# EAGLE design CPM_Pmod (EAGLE 6.4)
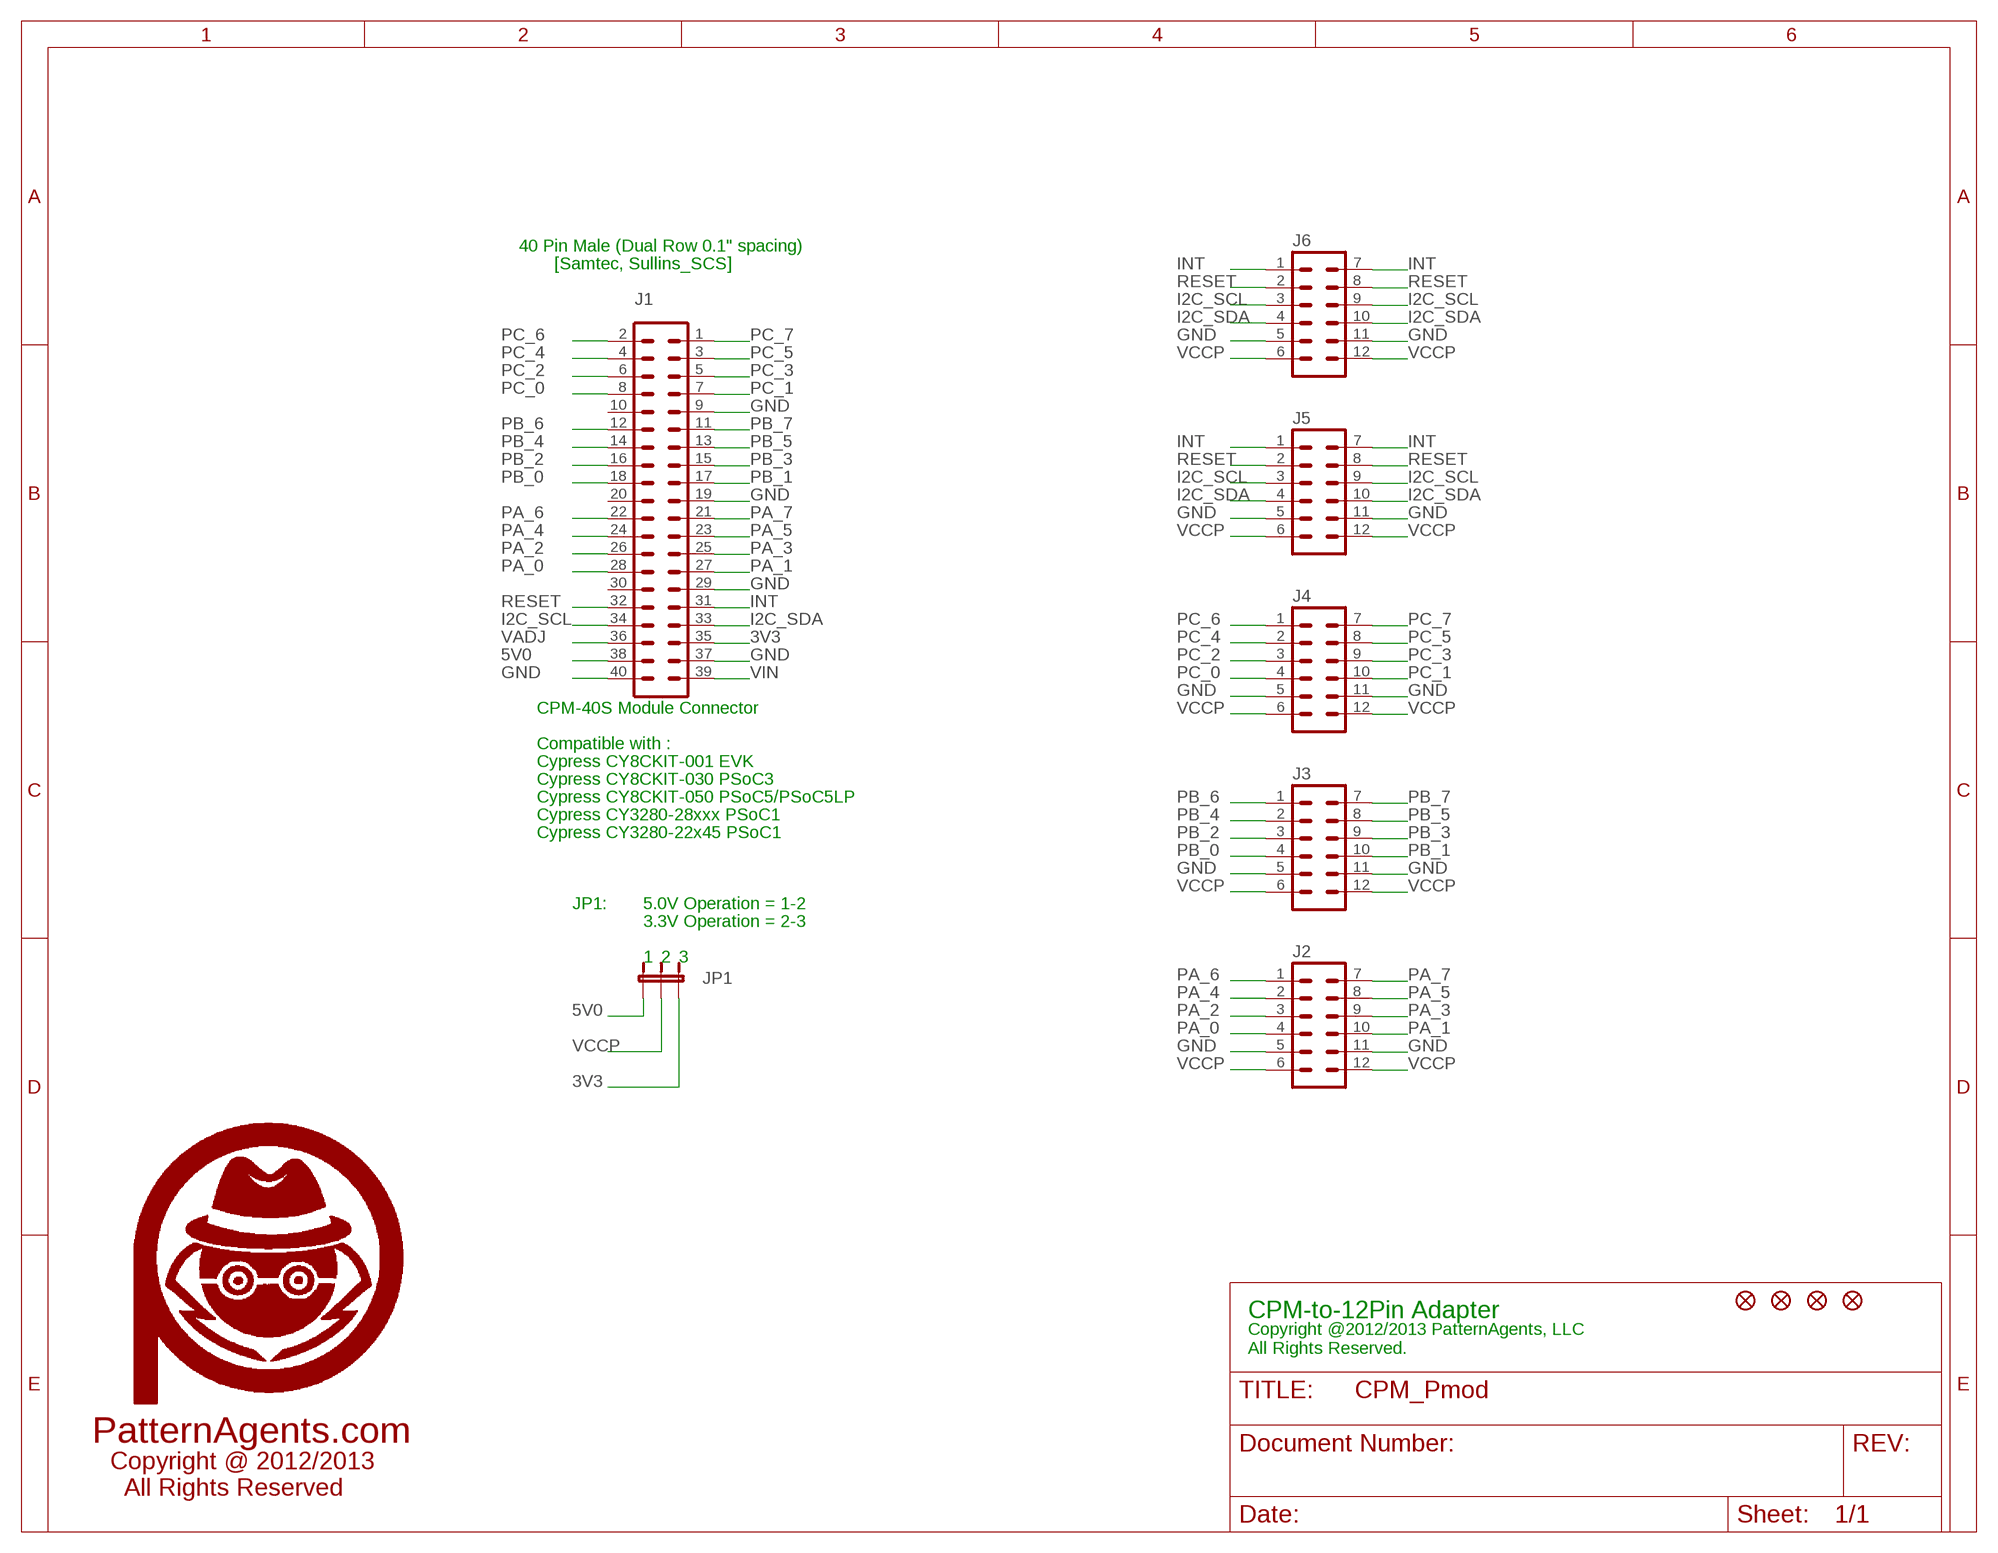
[diagram p0: schematic, sheet 1]

## Parts
J1  SULLINS_SCS  MA20-2  [MA20-2]
J2  MA06-2-PMOD  [MA06-2-PMOD]
J3  MA06-2-PMOD  [MA06-2-PMOD]
J4  MA06-2-PMOD  [MA06-2-PMOD]
J5  MA06-2-PMOD  [MA06-2-PMOD]
J6  MA06-2-PMOD  [MA06-2-PMOD]
JP1  JUMPER-3PTH  [1X03]
JP2  FIDUCIAL1.5X3  [FIDUCIAL-1.5X3]
JP3  FIDUCIAL1.5X3  [FIDUCIAL-1.5X3]
JP4  FIDUCIAL1.5X3  [FIDUCIAL-1.5X3]
JP5  FIDUCIAL1.5X3  [FIDUCIAL-1.5X3]
U$1  LOGO_PA_AGENTLARGE  [LOGO_PA_AGENT_LARGE]

## Nets
3V3: J1.35 JP1.3
5V0: J1.38 JP1.1
GND: J1.9 J1.19 J1.29 J1.37 J1.40 J2.5 J2.11 J3.5 J3.11 J4.5 J4.11 J5.5 J5.11 J6.5 J6.11
I2C_SCL: J1.34 J5.3 J5.9 J6.3 J6.9
I2C_SDA: J1.33 J5.4 J5.10 J6.4 J6.10
INT: J1.31 J5.1 J5.7 J6.1 J6.7
PA_0: J1.28 J2.4
PA_1: J1.27 J2.10
PA_2: J1.26 J2.3
PA_3: J1.25 J2.9
PA_4: J1.24 J2.2
PA_5: J1.23 J2.8
PA_6: J1.22 J2.1
PA_7: J1.21 J2.7
PB_0: J1.18 J3.4
PB_1: J1.17 J3.10
PB_2: J1.16 J3.3
PB_3: J1.15 J3.9
PB_4: J1.14 J3.2
PB_5: J1.13 J3.8
PB_6: J1.12 J3.1
PB_7: J1.11 J3.7
PC_0: J1.8 J4.4
PC_1: J1.7 J4.10
PC_2: J1.6 J4.3
PC_3: J1.5 J4.9
PC_4: J1.4 J4.2
PC_5: J1.3 J4.8
PC_6: J1.2 J4.1
PC_7: J1.1 J4.7
RESET: J1.32 J5.2 J5.8 J6.2 J6.8
VADJ: J1.36
VCCP: J2.6 J2.12 J3.6 J3.12 J4.6 J4.12 J5.6 J5.12 J6.6 J6.12 JP1.2
VIN: J1.39
Unconnected: J1.10 J1.20 J1.30

## Notes on the sheet
- 40 Pin Male (Dual Row 0.1" spacing)
- [Samtec, Sullins_SCS]
- CPM-40S Module Connector
- Compatible with :
- Cypress CY8CKIT-001 EVK
- Cypress CY8CKIT-030 PSoC3
- Cypress CY8CKIT-050 PSoC5/PSoC5LP
- Cypress CY3280-28xxx PSoC1
- Cypress CY3280-22x45 PSoC1
- JP1: | 5.0V Operation = 1-2
- 3.3V Operation = 2-3
- 1 | 2 | 3
- CPM-to-12Pin Adapter
- Copyright @2012/2013 PatternAgents, LLC
  All Rights Reserved.
- PatternAgents.com
- Copyright @ 2012/2013
    All Rights Reserved

## Library data of the parts
J1 = moxdes_V1_0:MA20-2: 40 PIN HEADER; MF: Sullins; MPN: PBC20DBAN; OC_FARNELL: unknown; OC_NEWARK: unknown
J2-J6 = moxdes_V1_0:MA06-2-PMOD
JP1 = SparkFun:JUMPER-3
JP2-JP5 = PatternAgents-Misc:FIDUCIAL: Fiducial Alignment Points Various fiducial points for machine vision alignment.
U$1 = PatternAgents-Aesthetics:LOGO_PA_AGENT: PatternAgents Logo Copyright @2012/2013 PatternAgents.com

## Board
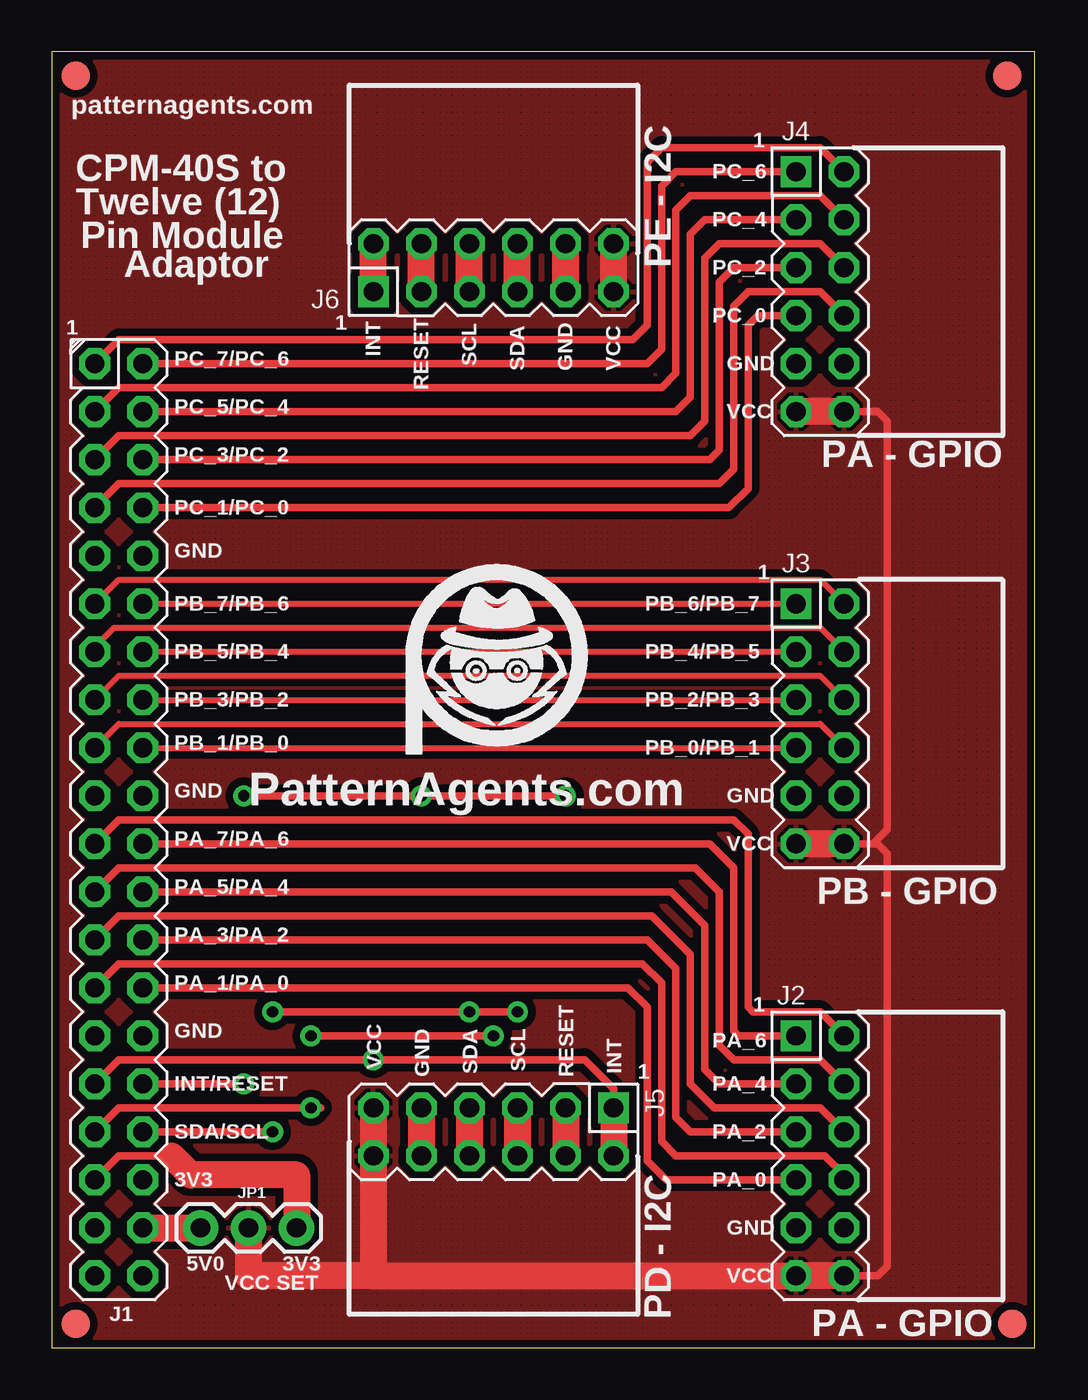
[diagram p1: board, top side]
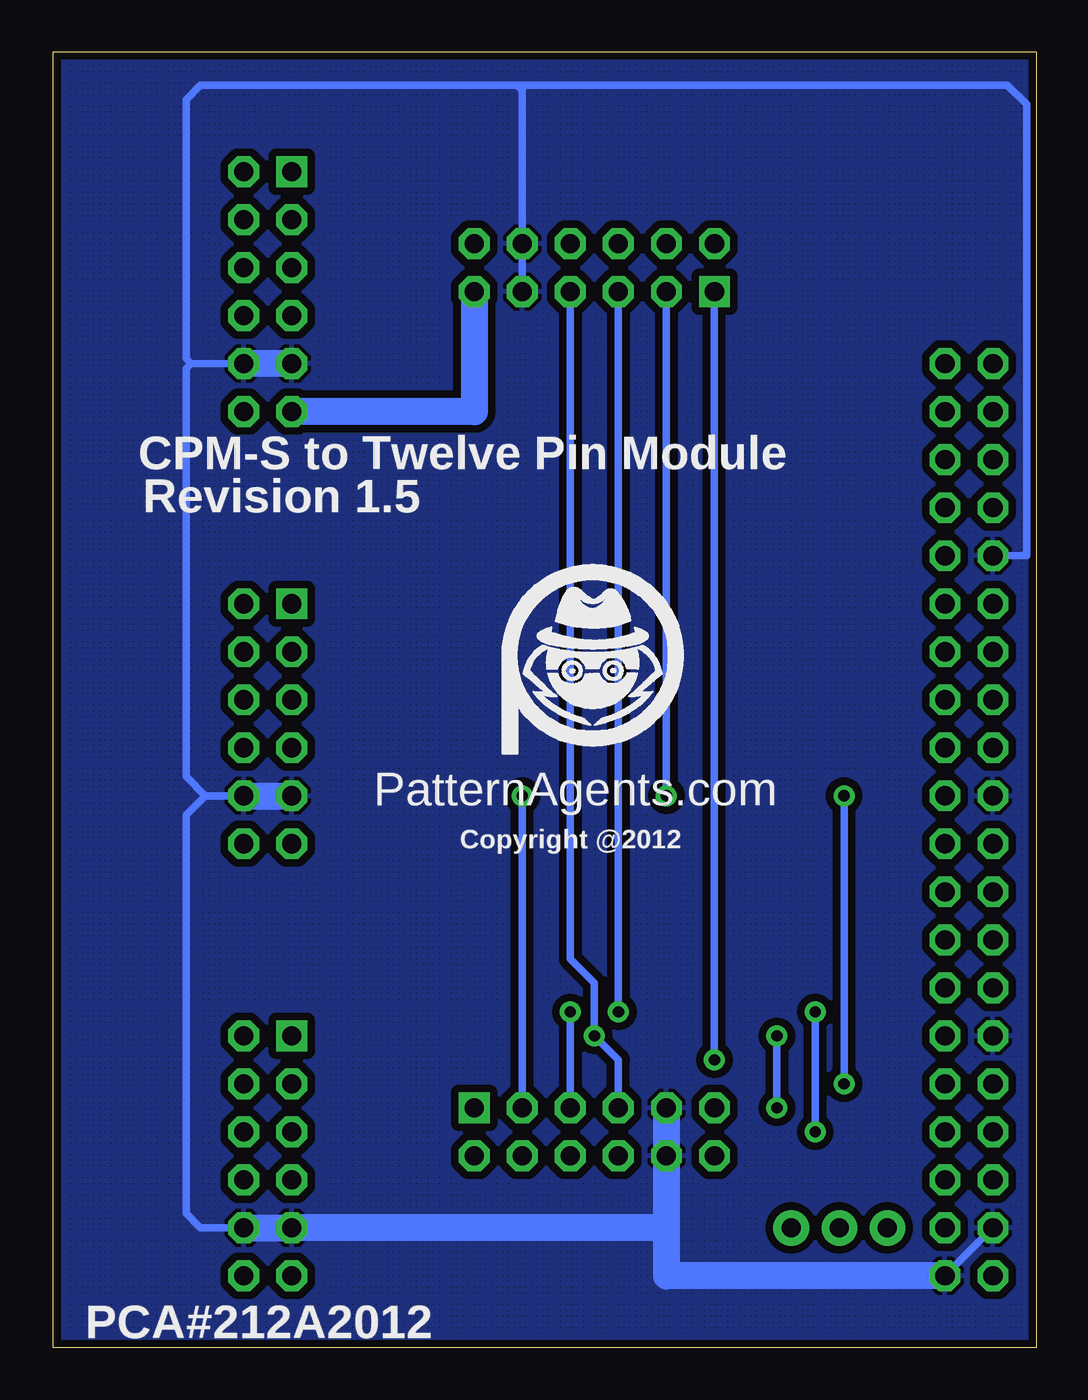
[diagram p2: board, bottom side, seen from below]

Size 51.99 x 68.57 mm. Coordinates in mm from the lower left corner, seen from the top.
Outline: 0,0 51.99,0 51.99,68.57 0,68.57 0,0
Copper layers (1*16): Top 0.035mm / dielectric 1.5mm / Bottom 0.035mm
Design rules "PatternAgents": minimum track width 8mil, minimum drill 14mil, track to track 8mil, track to pad 8mil, pad to pad 8mil, via to via 8mil, smd to smd 8mil, copper to edge 10mil, drill to drill 8mil, minimum pad ring 12mil, minimum via ring 10mil, stop-mask expansion 4mil, vias tented up to drill 25mil, thermal gap 8mil

### Footprints (pad centres in the part's own frame; a part is rotated, then mirrored left to right if it is on the bottom)
MA20-2 = drill 1.016 octagon: 1 -24.13,-1.27; 2 -24.13,1.27; 3 -21.59,-1.27; 4 -21.59,1.27; 5 -19.05,-1.27; 6 -19.05,1.27; 7 -16.51,-1.27; 8 -16.51,1.27; 9 -13.97,-1.27; 10 -13.97,1.27; 11 -11.43,-1.27; 12 -11.43,1.27; 13 -8.89,-1.27; 14 -8.89,1.27; 15 -6.35,-1.27; 16 -6.35,1.27; 17 -3.81,-1.27; 18 -3.81,1.27; 19 -1.27,-1.27; 20 -1.27,1.27; 21 1.27,-1.27; 22 1.27,1.27; 23 3.81,-1.27; 24 3.81,1.27; 25 6.35,-1.27; 26 6.35,1.27; 27 8.89,-1.27; 28 8.89,1.27; 29 11.43,-1.27; 30 11.43,1.27; 31 13.97,-1.27; 32 13.97,1.27; 33 16.51,-1.27; 34 16.51,1.27; 35 19.05,-1.27; 36 19.05,1.27; 37 21.59,-1.27; 38 21.59,1.27; 39 24.13,-1.27; 40 24.13,1.27
MA06-2-PMOD = drill 1.016 square: 1 -6.35,-1.27 | drill 1.016 octagon: 2 -3.81,-1.27; 3 -1.27,-1.27; 4 1.27,-1.27; 5 3.81,-1.27; 6 6.35,-1.27; 7 -6.35,1.27; 8 -3.81,1.27; 9 -1.27,1.27; 10 1.27,1.27; 11 3.81,1.27; 12 6.35,1.27
1X03 = drill 1.016 pad 1.88: 1 0,0; 2 2.54,0; 3 5.08,0
FIDUCIAL-1.5X3 = smd 1.5 x 1.5: 1 0,0

### Placement (x,y rotation side)
J1  3.56,27.94 270 top
J2  40.64,10.16 270 top
J3  40.64,33.02 270 top
J4  40.64,55.88 270 top
J5  23.37,11.43 180 top
J6  23.37,57.15 0 top
JP1  7.87,6.35 0 top
JP2  1.27,67.31 0 top
JP3  50.55,67.31 0 top
JP4  1.27,1.27 0 top
JP5  50.8,1.27 0 top
U$1  23.37,35.81 0 bottom
U$3  LOGO_PA_AGENTLARGE  [LOGO_PA_AGENT_LARGE]  23.62,35.81 0 top

### Tracks (layer width: path | path; a pad name or v marks a point on that pad's centre or on a via)
3V3
  Top 0.406: J1.35 3.56,10.16 6.35,10.16
  Top 1.422: JP1.3 12.95,9.14 7.37,9.14 6.35,10.16
5V0
  Top 1.422: J1.38 JP1.1
GND
  Top 1.422: J6.5 J6.11 | J5.5 J5.11
  Bottom 0.406: J1.37 J1.40 | J4.11 44.7,52.07 | 44.7,52.07 44.96,51.82 44.96,30.23 43.94,29.21 | J3.11 43.94,29.21 | 43.94,29.21 44.96,28.19 44.96,7.11 44.2,6.35 J2.11 | J1.9 0.51,41.91 0.51,65.79 1.52,66.8 27.43,66.8 | 27.43,66.8 44.2,66.8 44.96,66.04 44.96,52.32 44.7,52.07 | J6.5 27.18,66.55 27.43,66.8
  Bottom 1.422: J2.11 J2.5 19.56,6.35 | J4.5 J4.11 | J3.11 J3.5 | J1.40 19.56,3.81 19.56,6.35 | J5.5 19.56,6.35
  pour Bottom (isolate 0.406, hatched): 0,68.58 51.82,68.58 51.82,0 0,0
I2C_SCL  (via drill 0.6)
  Top 0.406: J1.34 v11.68,11.43 | v11.68,17.78 v22.1,17.78 v24.64,17.78
  Top 1.422: J6.3 J6.9 | J5.3 J5.9
  Bottom 0.406: v11.68,11.43 v11.68,17.78 | v24.64,17.78 J5.3 | J6.3 v22.1,17.78
I2C_SDA  (via drill 0.6)
  Top 0.406: J1.33 3.56,12.7 v13.72,12.7 14.22,12.7 | v23.37,16.51 v13.72,16.51
  Top 1.422: J6.4 J6.10 | J5.4 J5.10
  Bottom 0.406: v13.72,16.51 v13.72,12.7 | J5.4 22.1,15.24 v23.37,16.51 23.37,19.3 24.64,20.57 J6.4
INT  (via drill 0.6)
  Top 0.406: J1.31 3.56,15.24 v17.02,15.24 28.19,15.24 29.72,13.72 J5.1
  Top 1.422: J6.1 J6.7 | J5.1 J5.7
  Bottom 0.406: v17.02,15.24 J6.1
PA_0
  Top 0.406: J2.4 32.51,8.89 31.5,9.91 31.5,18.03 30.48,19.05 J1.28
PA_1
  Top 0.406: J2.10 41.91,9.14 40.89,10.16 33.02,10.16 32.26,10.92 32.26,19.3 31.24,20.32 3.56,20.32 J1.27
PA_2
  Top 0.406: J2.3 33.78,11.43 33.02,12.19 33.02,20.07 31.5,21.59 J1.26
PA_3
  Top 0.406: J2.9 40.64,12.7 35.05,12.7 33.78,13.97 33.78,20.83 31.75,22.86 3.56,22.86 J1.25
PA_4
  Top 0.406: J2.2 35.31,13.97 34.54,14.73 34.54,22.35 32.77,24.13 J1.24
PA_5
  Top 0.406: J2.8 40.64,15.24 36.07,15.24 35.31,16 35.31,24.13 34.04,25.4 3.56,25.4 J1.23
PA_6
  Top 0.406: J2.1 36.32,16.51 36.07,16.76 36.07,25.4 34.8,26.67 J1.22
PA_7
  Top 0.406: J2.7 40.64,17.78 37.08,17.78 36.83,18.03 36.83,27.18 36.07,27.94 3.56,27.94 J1.21
PB_0
  Top 0.305: J1.18 J3.4
PB_1
  Top 0.305: J1.17 3.56,33.02 40.64,33.02 J3.10
PB_2
  Top 0.305: J1.16 J3.3
PB_3
  Top 0.305: J1.15 3.56,35.56 40.64,35.56 J3.9
PB_4
  Top 0.305: J1.14 J3.2
PB_5
  Top 0.305: J1.13 2.29,37.08 3.3,38.1 40.64,38.1 J3.8
PB_6
  Top 0.305: J1.12 J3.1
PB_7
  Top 0.305: J1.11 3.56,40.64 40.64,40.64 J3.7
PC_0
  Top 0.406: J1.8 35.81,44.45 36.83,45.47 36.83,54.1 37.34,54.61 J4.4
PC_1
  Top 0.406: J1.7 3.56,45.72 35.31,45.72 36.07,46.48 36.07,55.12 36.83,55.88 40.64,55.88 J4.10
PC_2
  Top 0.406: J4.3 36.07,57.15 35.31,56.39 35.31,47.5 34.8,46.99 J1.6
PC_3
  Top 0.406: J4.9 40.64,58.42 35.31,58.42 34.54,57.66 34.54,49.02 33.78,48.26 3.56,48.26 J1.5
PC_4
  Top 0.406: J4.2 34.54,59.69 33.78,58.93 33.78,50.29 33.02,49.53 J1.4
PC_5
  Top 0.406: J1.3 3.56,50.8 32.26,50.8 33.02,51.56 33.02,60.2 33.78,60.96 40.64,60.96 J4.8
PC_6
  Top 0.406: J4.1 33.02,62.23 32.26,61.47 32.26,52.83 31.5,52.07 J1.2
PC_7
  Top 0.406: J1.1 3.56,53.34 30.73,53.34 31.5,54.1 31.5,62.74 32.26,63.5 40.64,63.5 J4.7
RESET  (via drill 0.6)
  Top 0.406: J1.32 v10.16,13.97 | v10.16,29.21 v19.56,29.21 v27.18,29.21
  Top 1.422: J6.2 J6.8 | J5.2 J5.8
  Bottom 0.406: v10.16,13.97 v10.16,29.21 | J6.2 v19.56,29.21 | J5.2 v27.18,29.21
VCCP
  Top 0.406: J2.12 43.69,3.81 44.2,4.32 44.2,26.16 43.69,26.67 J3.12 43.43,26.67 44.2,27.43 44.2,49.02 43.69,49.53 J4.12
  Top 1.422: J2.12 J2.6 17.02,3.81 | J3.12 J3.6 | J4.12 J4.6 | J6.6 J6.12 | J5.12 J5.6 17.02,3.81 | 17.02,3.81 10.41,3.81 JP1.2
  Bottom 1.422: J6.6 29.72,49.53 J4.6
  pour Top (isolate 0.406, hatched): 0,68.58 51.82,68.58 51.82,0 0,0

### Text on the board
tPlace: patternagents.com | 1 | CPM-40S to | PC_6 | Twelve (12) | PC_4 | Pin Module | Adaptor | PE - I2C | PC_2 | 1 | 1 | PC_0 | PC_7/PC_6 | INT | SCL | SDA | GND | VCC | GND | RESET | PC_5/PC_4 | VCC | PA - GPIO | PC_3/PC_2 | PC_1/PC_0 | GND | 1 | PB_7/PB_6 | PB_6/PB_7 | PB_5/PB_4 | PB_4/PB_5 | PB_3/PB_2 | PB_2/PB_3 | PB_1/PB_0 | PB_0/PB_1 | GND | PatternAgents.com | GND | PA_7/PA_6 | VCC | PB - GPIO | PA_5/PA_4 | PA_3/PA_2 | PA_1/PA_0 | RESET | 1 | VCC | GND | SDA | SCL | GND | INT | PA_6 | INT/RESET | 1 | PA_4 | SDA/SCL | PA_2 | 3V3 | PA_0 | GND | 5V0 | 3V3 | VCC SET | VCC | PD - I2C | PA - GPIO
bPlace: CPM-S to Twelve Pin Module | Revision 1.5 | PatternAgents.com | Copyright @2012 | PCA#212A2012